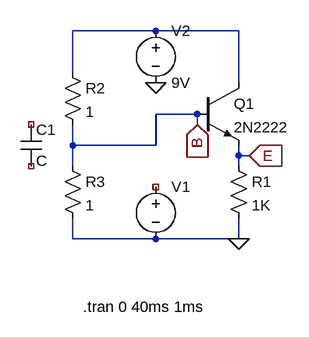
[diagram p0: schematic Emitter Follower Project.asc]
Emitter Follower Project.asc, the LTspice schematic file:
Version 4
SHEET 1 880 680
WIRE 176 112 48 112
WIRE 304 112 176 112
WIRE 48 176 48 112
WIRE 304 192 304 112
WIRE 240 240 176 240
WIRE 240 256 240 240
WIRE 48 288 48 256
WIRE 176 288 176 240
WIRE 176 288 48 288
WIRE 304 304 304 288
WIRE 320 304 304 304
WIRE 48 320 48 288
WIRE 304 320 304 304
WIRE 48 432 48 400
WIRE 176 432 48 432
WIRE 304 432 304 400
WIRE 304 432 176 432
FLAG 304 432 0
FLAG 176 192 0
FLAG 240 256 B
IOPIN 240 256 In
FLAG 320 304 E
IOPIN 320 304 In
SYMBOL npn 240 192 R0
SYMATTR InstName Q1
SYMATTR Value 2N2222
SYMBOL voltage 176 336 R0
WINDOW 3 24 96 Invisible 2
SYMATTR Value SINE(4 4 100 0 0 0 4)
SYMATTR InstName V1
SYMBOL res 288 304 R0
SYMATTR InstName R1
SYMATTR Value 1K
SYMBOL voltage 176 96 R0
SYMATTR InstName V2
SYMATTR Value 9V
SYMBOL res 32 160 R0
SYMATTR InstName R2
SYMATTR Value 1
SYMBOL res 32 304 R0
SYMATTR InstName R3
SYMATTR Value 1
SYMBOL cap -32 256 R0
SYMATTR InstName C1
TEXT 64 536 Left 2 !.tran 0 40ms 1ms

The netlist it stands for:
* Emitter Follower Project.asc
Q1 N001 B E 0 2N2222
V1 NC_01 0 SINE(4 4 100 0 0 0 4)
R1 E 0 1K
V2 N001 0 9V
R2 N001 B 1
R3 B 0 1
C1 NC_02 NC_03 C
.model NPN NPN
.model PNP PNP
.lib standard.bjt
.tran 0 40ms 1ms
.backanno
.end